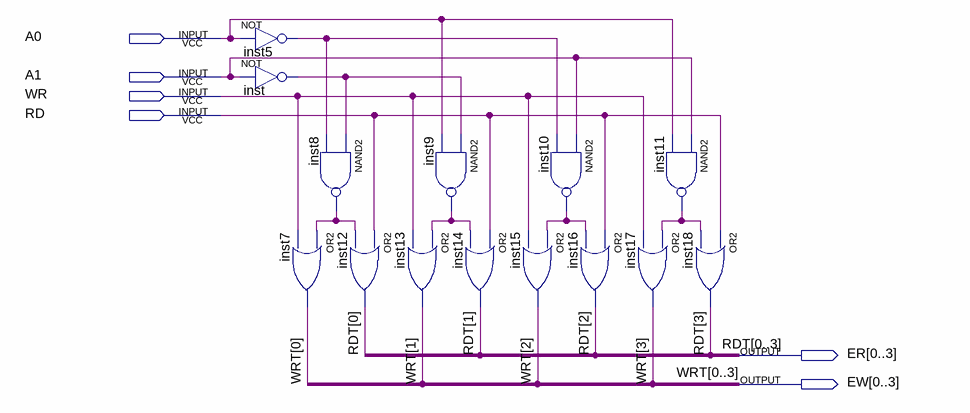
[diagram p0: schematic sheet]
// Quartus schematic Decoder24.bdf as structural Verilog: 14 symbols, 6 pins
module Decoder24 (
  input  A0,
  input  A1,
  input  WR,
  input  RD,
  output [0:3] ER,
  output [0:3] EW
);

  wire inst5_out, inst8_out, inst9_out, inst10_out, inst11_out, inst_out;

  not inst5 (inst5_out, A0);
  not inst (inst_out, A1);
  or inst7 (EW[0], inst8_out, WR);
  nand inst8 (inst8_out, inst_out, inst5_out);
  or inst12 (ER[0], RD, inst8_out);
  nand inst9 (inst9_out, inst_out, A0);
  or inst13 (EW[1], inst9_out, WR);
  or inst14 (ER[1], RD, inst9_out);
  or inst15 (EW[2], inst10_out, WR);
  nand inst10 (inst10_out, A1, inst5_out);
  or inst16 (ER[2], RD, inst10_out);
  nand inst11 (inst11_out, A1, A0);
  or inst17 (EW[3], inst11_out, WR);
  or inst18 (ER[3], RD, inst11_out);

  // Other names for the same wires on the sheet: RDT[3:0] = {ER[3], ER[2], ER[1], ER[0]};
  //   WRT[3:0] = {EW[3], EW[2], EW[1], EW[0]}
endmodule
